# EAGLE schematic ShiftReg+Accel (EAGLE 7.6.0)
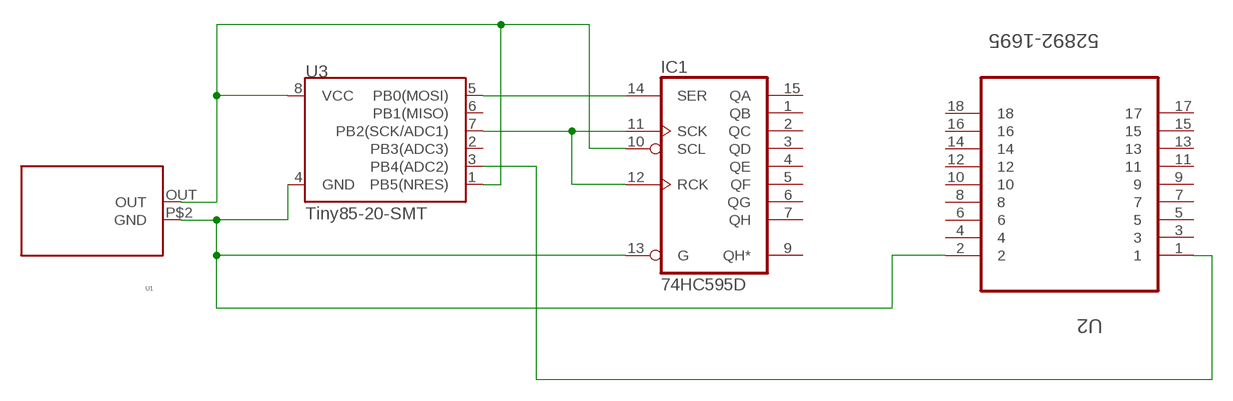
[diagram p0: schematic, sheet 1]

## Parts
IC1  74HC595D  [SO16]
U1  P9027LP-R  [P9027LP-R]
U2  52892-1695  [MOLEX_52892-1695]
U3  Tiny85-20-SMT  ATTINY45TINY85-20-SMT  [SO08-EIAJ]

## Nets
N$1: IC1.10(SCL) U1.OUT U3.1(PB5(NRES)) U3.8(VCC)
N$2: IC1.13(G) U1.P$2(GND) U2.2 U3.4(GND)
N$3: IC1.11(SCK) IC1.12(RCK) U3.7(PB2(SCK/ADC1))
N$4: IC1.14(SER) U3.5(PB0(MOSI))
N$6: U2.1 U3.3(PB4(ADC2))
Unconnected: IC1.1(QB) IC1.2(QC) IC1.3(QD) IC1.4(QE) IC1.5(QF) IC1.6(QG) IC1.7(QH) IC1.9(QH*) IC1.15(QA) U2.3 U2.4 U2.5 U2.6 U2.7 U2.8 U2.9 U2.10 U2.11 U2.12 U2.13 U2.14 U2.15 U2.16 U2.17 U2.18 U3.2(PB3(ADC3)) U3.6(PB1(MISO))

## Power pins joined to a net without a drawn wire
GND: IC1.8(GND)
VCC: IC1.16(VCC)

## Library data of the parts
IC1 = 74xx:74*595: 8-bit SHIFT REGISTER, output latch
U1 = GeekAmmo:P9027LP-R
U2 = Molex_By_element14_Batch_1:52892-1695: CONNECTOR, FPC, ZIF, 0.50MM, 16 WAY; MPN: 52892-1695; OC_FARNELL: 1556807; OC_NEWARK: 92M6601; PACKAGE: CONNECTOR, FPC, ZIF, 0.50MM, 16 WAY; SUPPLIER: Molex
U3 = SparkFun-DigitalIC:ATTINY45: Atmel 8-pin 2/4/8kB flash uC; PROD_ID: IC-09092